# Altium schematic sheet edgeDetector.SchDoc
size A
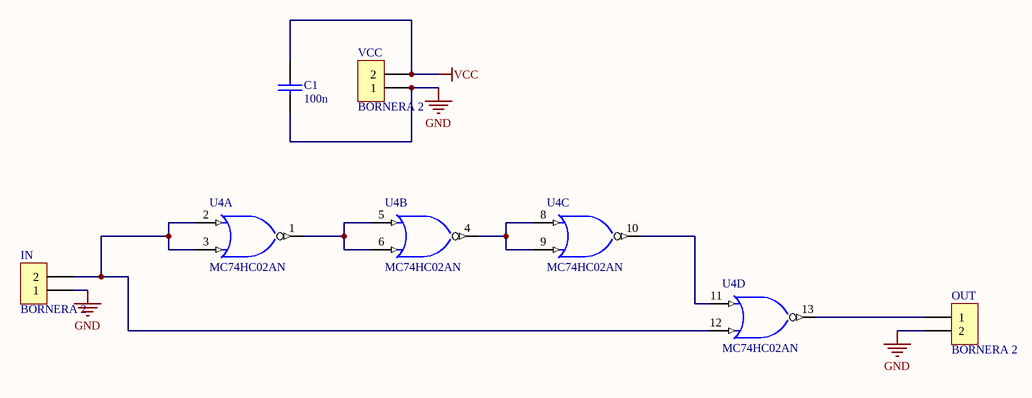
[diagram p0: edgeDetector.SchDoc]

## Parts
C1  100n  [0805]
IN  BORNERA 2  [BORNERA2]
OUT  BORNERA 2  [BORNERA2]
U4  MC74HC02AN  [646-06]  (parts A,B,C,D of 4)
VCC  BORNERA 2  [BORNERA2]

## Nets
GND: C1.2 IN.1 OUT.2 U4.7(GND) VCC.1
VCC: C1.1 U4.14(VCC) VCC.2
NetIN_2: IN.2 U4.2(A) U4.3(B) U4.12(B)
NetOUT_1: OUT.1 U4.13(~{Y})
NetU4_1: U4.1(~{Y}) U4.5(A) U4.6(B)
NetU4_4: U4.4(~{Y}) U4.8(A) U4.9(B)
NetU4_10: U4.10(~{Y}) U4.11(A)

## Library data of the parts
C1 = CAP
U4 = MC74HC02AN: Quad 2-Input NOR Gate; Published: 15-Apr-2002; DatasheetVersion: Mar-2000; PackageVersion: 1995; PackageReference: 646-06; Publisher: Altium Limited; PackageDescription: DIP; 14 Leads; Row Spacing 7.62 mm; Pitch 2.54 mm; ComponentLink1Description: Manufacturer Link; ComponentLink1URL: http://www.onsemi.com/; ComponentLink2Description: Datasheet; ComponentLink2URL: http://www.onsemi.com/pub/Collateral/MC74HC02A-D.PDF